# Altium project design.PrjPcb
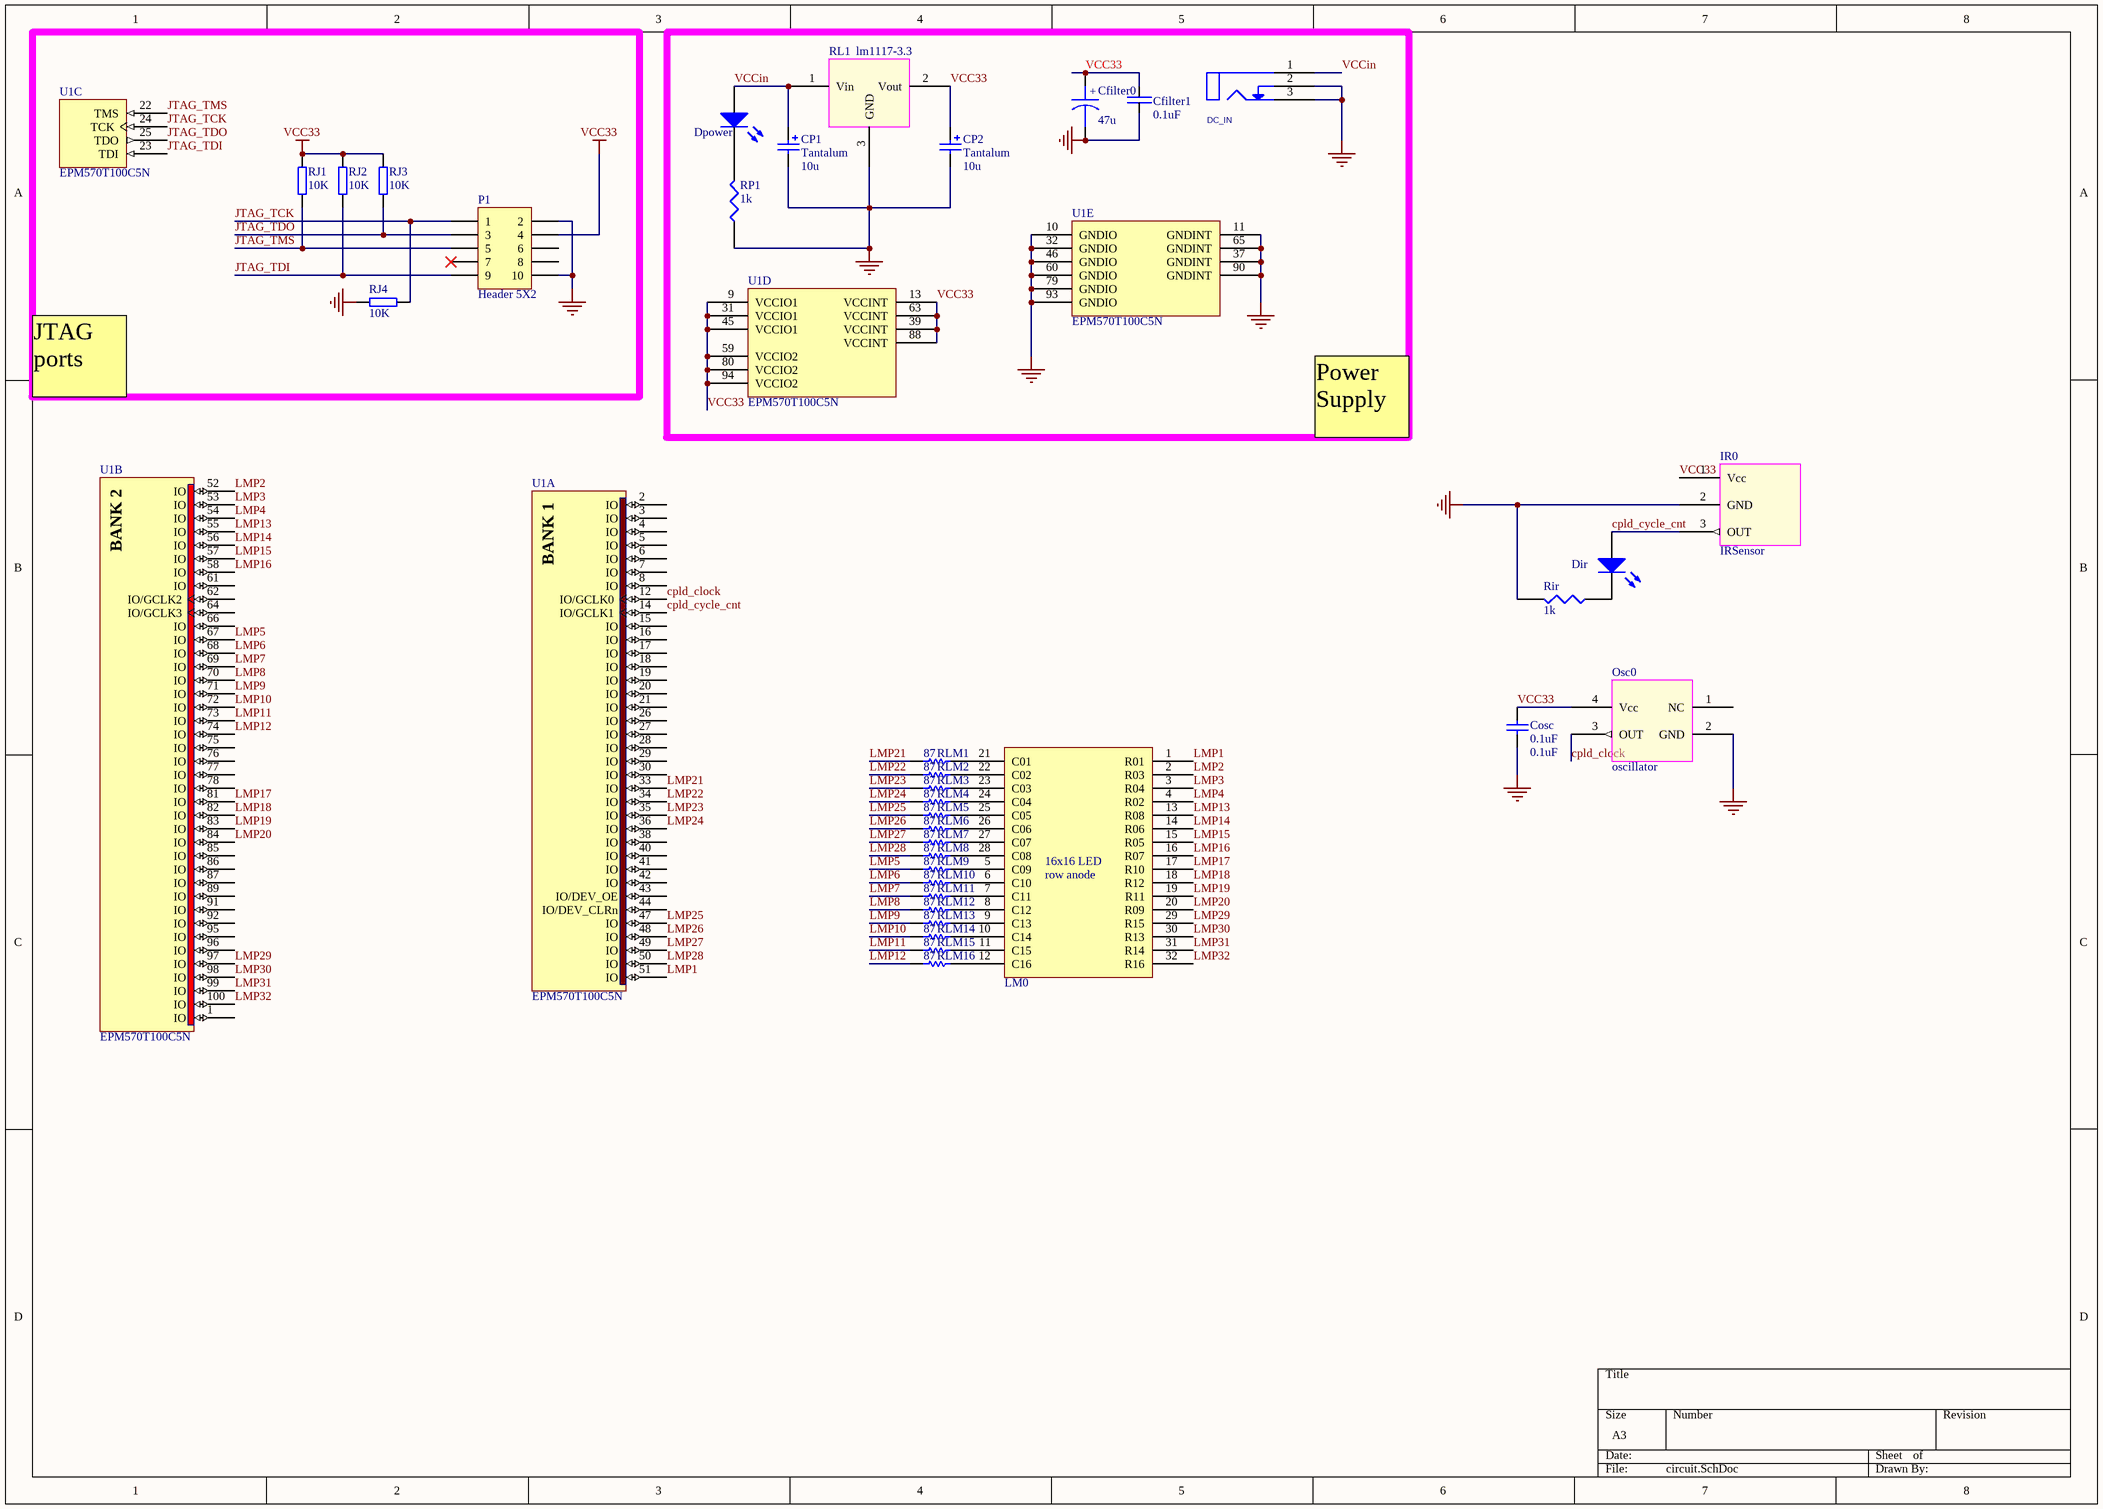
[diagram p0: circuit.SchDoc]
1 sheet, 36 parts. Net scope: global (net labels, ports and power ports of the same name join across sheets).
Board file: circuit.PcbDoc

## Sheet circuit.SchDoc
size A3

### Parts
Cfilter0  47u  [3216C]
Cfilter1  0.1uF  [0805]
Cosc  0.1uF  [0805]
CP1  Tantalum  value 10u  [3216]
CP2  Tantalum  value 10u  [3216]
DC_IN  DC input  [DC_JACK]  (value not drawn)
Dir  LED0  [0805]  (value not drawn)
Dpower  LED0  [0805]  (value not drawn)
IR0  IRSensor  [IRSENSOR_4PIN]
LM0  LM2256-LEDMat  [LM2256]  (value not drawn)
Osc0  oscillator  [osc1]
P1  Header 5X2  [IDC10]
Rir  1k  [0805]
RJ1  10K  [0805]
RJ2  10K  [0805]
RJ3  10K  [0805]
RJ4  10K  [0805]
RL1  lm1117-3.3  [SOT-223]
RLM1  87  [0805]
RLM2  87  [0805]
RLM3  87  [0805]
RLM4  87  [0805]
RLM5  87  [0805]
RLM6  87  [0805]
RLM7  87  [0805]
RLM8  87  [0805]
RLM9  87  [0805]
RLM10  87  [0805]
RLM11  87  [0805]
RLM12  87  [0805]
RLM13  87  [0805]
RLM14  87  [0805]
RLM15  87  [0805]
RLM16  87  [0805]
RP1  1k  [0805]
U1  EPM570T100C5N  [TQFP100_N]  (parts A,B,C,D,E of 5)

### Nets
GND: Cfilter0.2 Cfilter1.2 Cosc.1 CP1.2 CP2.2 DC_IN.2 DC_IN.3 IR0.2(GND) Osc0.2(GND) P1.2 P1.10 Rir.2 RJ4.2 RL1.3(GND) RP1.1 U1.10(GNDIO) U1.11(GNDINT) U1.32(GNDIO) U1.37(GNDINT) U1.46(GNDIO) U1.60(GNDIO) U1.65(GNDINT) U1.79(GNDIO) U1.90(GNDINT) U1.93(GNDIO)
VCC33: Cfilter0.1 Cfilter1.1 Cosc.2 CP2.1 IR0.1(Vcc) Osc0.4(Vcc) P1.4 RJ1.1 RJ2.1 RJ3.1 RL1.2(Vout) U1.9(VCCIO1) U1.13(VCCINT) U1.31(VCCIO1) U1.39(VCCINT) U1.45(VCCIO1) U1.59(VCCIO2) U1.63(VCCINT) U1.80(VCCIO2) U1.88(VCCINT) U1.94(VCCIO2)
cpld_clock: Osc0.3(OUT) U1.12(IO/GCLK0)
cpld_cycle_cnt: Dir.1(A) IR0.3(OUT) U1.14(IO/GCLK1)
JTAG_TCK: P1.1 RJ4.1 U1.24(TCK)
JTAG_TDI: P1.9 RJ2.2 U1.23(TDI)
JTAG_TDO: P1.3 RJ3.2 U1.25(TDO)
JTAG_TMS: P1.5 RJ1.2 U1.22(TMS)
LMP1: LM0.1(R01) U1.51(IO)
LMP2: LM0.2(R03) U1.52(IO)
LMP3: LM0.3(R04) U1.53(IO)
LMP4: LM0.4(R02) U1.54(IO)
LMP5: RLM9.1 U1.67(IO)
LMP6: RLM10.1 U1.68(IO)
LMP7: RLM11.1 U1.69(IO)
LMP8: RLM12.1 U1.70(IO)
LMP9: RLM13.1 U1.71(IO)
LMP10: RLM14.1 U1.72(IO)
LMP11: RLM15.1 U1.73(IO)
LMP12: RLM16.1 U1.74(IO)
LMP13: LM0.13(R08) U1.55(IO)
LMP14: LM0.14(R06) U1.56(IO)
LMP15: LM0.15(R05) U1.57(IO)
LMP16: LM0.16(R07) U1.58(IO)
LMP17: LM0.17(R10) U1.81(IO)
LMP18: LM0.18(R12) U1.82(IO)
LMP19: LM0.19(R11) U1.83(IO)
LMP20: LM0.20(R09) U1.84(IO)
LMP21: RLM1.1 U1.33(IO)
LMP22: RLM2.1 U1.34(IO)
LMP23: RLM3.1 U1.35(IO)
LMP24: RLM4.1 U1.36(IO)
LMP25: RLM5.1 U1.47(IO)
LMP26: RLM6.1 U1.48(IO)
LMP27: RLM7.1 U1.49(IO)
LMP28: RLM8.1 U1.50(IO)
LMP29: LM0.29(R15) U1.97(IO)
LMP30: LM0.30(R13) U1.98(IO)
LMP31: LM0.31(R14) U1.99(IO)
LMP32: LM0.32(R16) U1.100(IO)
VCCin: CP1.1 DC_IN.1 Dpower.1(A) RL1.1(Vin)
NetDir_2: Dir.2(K) Rir.1
NetDpower_2: Dpower.2(K) RP1.2
NetLM0_5: LM0.5(C09) RLM9.2
NetLM0_6: LM0.6(C10) RLM10.2
NetLM0_7: LM0.7(C11) RLM11.2
NetLM0_8: LM0.8(C12) RLM12.2
NetLM0_9: LM0.9(C13) RLM13.2
NetLM0_10: LM0.10(C14) RLM14.2
NetLM0_11: LM0.11(C15) RLM15.2
NetLM0_12: LM0.12(C16) RLM16.2
NetLM0_21: LM0.21(C01) RLM1.2
NetLM0_22: LM0.22(C02) RLM2.2
NetLM0_23: LM0.23(C03) RLM3.2
NetLM0_24: LM0.24(C04) RLM4.2
NetLM0_25: LM0.25(C05) RLM5.2
NetLM0_26: LM0.26(C06) RLM6.2
NetLM0_27: LM0.27(C07) RLM7.2
NetLM0_28: LM0.28(C08) RLM8.2

Not connected (* = marked no-connect by the designer): IR0 4; Osc0 1(NC); P1 6 7* 8; U1 1(IO) 2(IO) 3(IO) 4(IO) 5(IO) 6(IO) 7(IO) 8(IO) 15(IO) 16(IO) 17(IO) 18(IO) 19(IO) 20(IO) 21(IO) 26(IO) 27(IO) 28(IO) 29(IO) 30(IO) 38(IO) 40(IO) 41(IO) 42(IO) 43(IO/DEV_OE) 44(IO/DEV_CLRn) 61(IO) 62(IO/GCLK2) 64(IO/GCLK3) 66(IO) 75(IO) 76(IO) 77(IO) 78(IO) 85(IO) 86(IO) 87(IO) 89(IO) 91(IO) 92(IO) 95(IO) 96(IO)

### Notes on the sheet
- JTAG ports
- Power Supply
- (in symbol CAPACITOR POL) +
- (in symbol EPM570T100C5N, part A) BANK 1
- (in symbol EPM570T100C5N, part B) BANK 2
- (in symbol LM2256-LEDMat) 16x16 LED; row anode

### Library data of the parts
Cfilter0 = CAPACITOR POL: Capacitor
Cfilter1 = CAP: Capacitor
Cosc = Cap: Capacitor; Published: 8-Jun-2000; LatestRevisionDate: 17-Jul-2002; LatestRevisionNote: Re-released for DXP Platform.; PackageReference: RAD-0.3; Publisher: Altium Limited; Value: 0.1uF
CP1 CP2 = Cap Pol3: Polarized Capacitor (Surface Mount); Published: 8-Jun-2000; LatestRevisionDate: 29-May-2009; LatestRevisionNote: IPC-7351 Footprint Added.; PackageReference: C0805; Publisher: Altium Limited; PackageDescription: Chip Capacitor
DC_IN = CONN JACK PWR
Dir Dpower = LED0: Typical INFRARED GaAs LED; Published: 8-Jun-2000; LatestRevisionDate: 08-Jul-2005; LatestRevisionNote: Mech Layer 1 removed.; PackageReference: LED-0; Publisher: Altium Limited
P1 = Header 5X2: Header, 5-Pin, Dual row; LatestRevisionDate: 17-Jul-2002; LatestRevisionNote: Re-released for DXP Platform.; Publisher: Altium Limited
Rir RP1 = Res1
RJ1-RJ4 = Res2
RL1 = lm1117
RLM1-RLM16 = Res1: Resistor; Published: 8-Jun-2000; LatestRevisionDate: 17-Jul-2002; LatestRevisionNote: Re-released for DXP Platform.; PackageReference: AXIAL-0.3; Publisher: Altium Limited; Value: 87
U1 = EPM570T100C5N: MAX II 3.3/2.5V CPLD, 76 IOs, 570 Logic Elements, 100-Pin Plastic TQFP, Commercial Temperature, Speed Grade 5, Pb-Free; Note: Each set of VCCIO pins can be connected to 3.3V, 2.5V, 1.8V, or 1.5V.; Note: All VCCINT pins must be connected to either 3.3V or 2.5V (but not a combination of both).; Published: 4-Mar-2005; LatestRevisionDate: 13-Apr-2006; LatestRevisionNote: IPC-7351 Footprint Added.; DatasheetVersion: ver1.8, Jul-2006; PackageVersion: ver14.3, Jul-2006; PackageReference: TQFP100; Publisher: Altium Limited; PackageDescription: 100-Pin Plastic Thin Quad Flat Pack (TQFP100); Code_JEDEC: MS-026-AED; ComponentLink1Description: Manufacturer Link; ComponentLink1URL: http://www.altera.com/products/devices/cpld/max2/mx2-index.jsp; ComponentLink2Description: Handbook; ComponentLink2URL: http://www.altera.com/literature/hb/max2/max2_mii5v1.pdf; ComponentLink3Description: Packaging Specification; ComponentLink3URL: http://www.altera.com/literature/ds/dspkg.pdf